# Altium schematic sheet ledstripes.SchDoc
size 209 x 148 mm; Organization: LieBtrau; DocumentNumber: 1; SheetNumber: 1; SheetTotal: 1
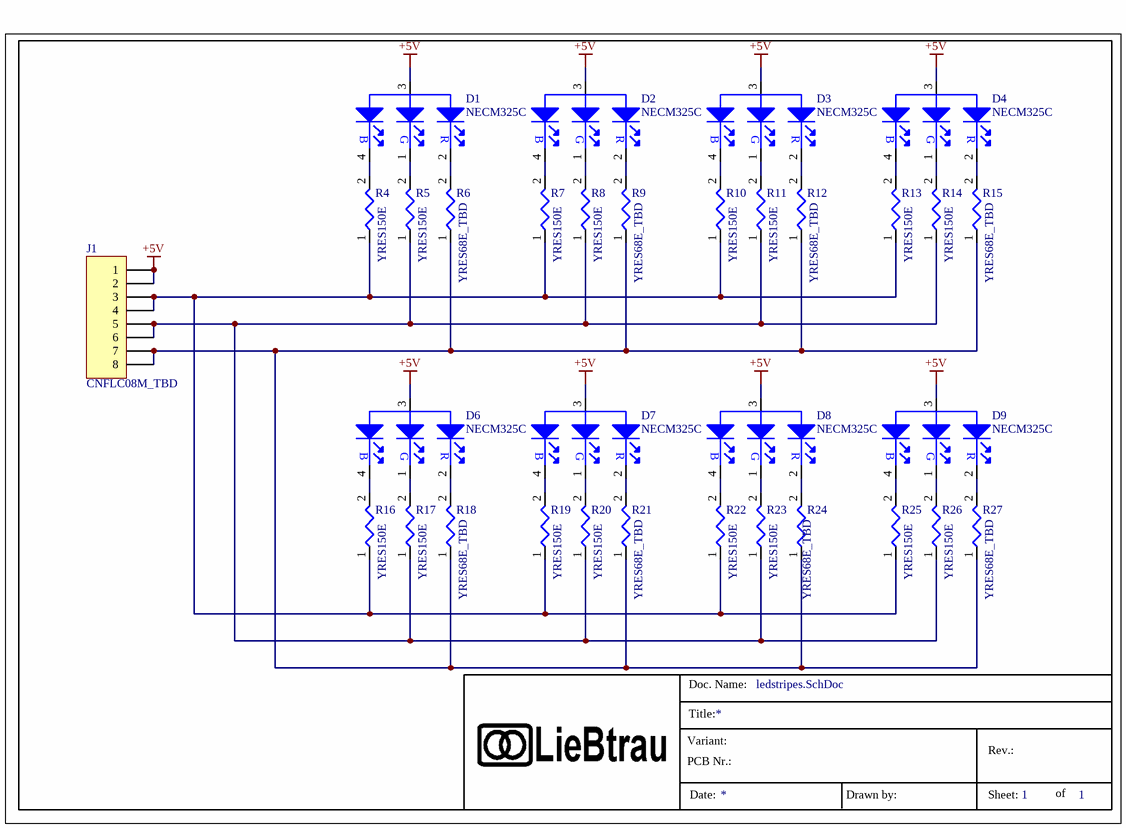
[diagram p0: ledstripes.SchDoc]

## Parts
D1  NECM325C  [D_NECM325C]
D2  NECM325C  [D_NECM325C]
D3  NECM325C  [D_NECM325C]
D4  NECM325C  [D_NECM325C]
D6  NECM325C  [D_NECM325C]
D7  NECM325C  [D_NECM325C]
D8  NECM325C  [D_NECM325C]
D9  NECM325C  [D_NECM325C]
J1  CNFLC08M_TBD  [J_215079-8]
R4  YRES150E  [R_1206]
R5  YRES150E  [R_1206]
R6  YRES68E_TBD  [R_1206]
R7  YRES150E  [R_1206]
R8  YRES150E  [R_1206]
R9  YRES68E_TBD  [R_1206]
R10  YRES150E  [R_1206]
R11  YRES150E  [R_1206]
R12  YRES68E_TBD  [R_1206]
R13  YRES150E  [R_1206]
R14  YRES150E  [R_1206]
R15  YRES68E_TBD  [R_1206]
R16  YRES150E  [R_1206]
R17  YRES150E  [R_1206]
R18  YRES68E_TBD  [R_1206]
R19  YRES150E  [R_1206]
R20  YRES150E  [R_1206]
R21  YRES68E_TBD  [R_1206]
R22  YRES150E  [R_1206]
R23  YRES150E  [R_1206]
R24  YRES68E_TBD  [R_1206]
R25  YRES150E  [R_1206]
R26  YRES150E  [R_1206]
R27  YRES68E_TBD  [R_1206]

## Nets
+5V: D1.3(A) D2.3(A) D3.3(A) D4.3(A) D6.3(A) D7.3(A) D8.3(A) D9.3(A) J1.1 J1.2
NetD1_1: D1.1(C) R5.2
NetD1_2: D1.2(C) R6.2
NetD1_4: D1.4(C) R4.2
NetD2_1: D2.1(C) R8.2
NetD2_2: D2.2(C) R9.2
NetD2_4: D2.4(C) R7.2
NetD3_1: D3.1(C) R11.2
NetD3_2: D3.2(C) R12.2
NetD3_4: D3.4(C) R10.2
NetD4_1: D4.1(C) R14.2
NetD4_2: D4.2(C) R15.2
NetD4_4: D4.4(C) R13.2
NetD6_1: D6.1(C) R17.2
NetD6_2: D6.2(C) R18.2
NetD6_4: D6.4(C) R16.2
NetD7_1: D7.1(C) R20.2
NetD7_2: D7.2(C) R21.2
NetD7_4: D7.4(C) R19.2
NetD8_1: D8.1(C) R23.2
NetD8_2: D8.2(C) R24.2
NetD8_4: D8.4(C) R22.2
NetD9_1: D9.1(C) R26.2
NetD9_2: D9.2(C) R27.2
NetD9_4: D9.4(C) R25.2
NetJ1_3: J1.3 J1.4 R4.1 R7.1 R10.1 R13.1 R16.1 R19.1 R22.1 R25.1
NetJ1_5: J1.5 J1.6 R5.1 R8.1 R11.1 R14.1 R17.1 R20.1 R23.1 R26.1
NetJ1_7: J1.7 J1.8 R6.1 R9.1 R12.1 R15.1 R18.1 R21.1 R24.1 R27.1

## Notes on the sheet
- Title:
- Doc. Name:
- Variant:
- PCB Nr.:
- Rev.:
- Date:
- Drawn by:
- Sheet:
- of
- (in symbol NECM325C) B; G; R

## Library data of the parts
J1 = CNFLC08F_TBD: *; Order Code: Farnell 1641857; Part Number: CNFLC08F_TBD
R4 R5 R7 R8 R10 R11 R13 R14 R16 R17 R19 R20 R22 R23 R25 R26 = YRES150E: Resistor; Part Number: YRES150E
R6 R9 R12 R15 R18 R21 R24 R27 = YRES68E_TBD: Resistor; Part Number: YRES68E_TBD
D1-D4 D6-D9 = NECM325C: Part Number: NECM325C